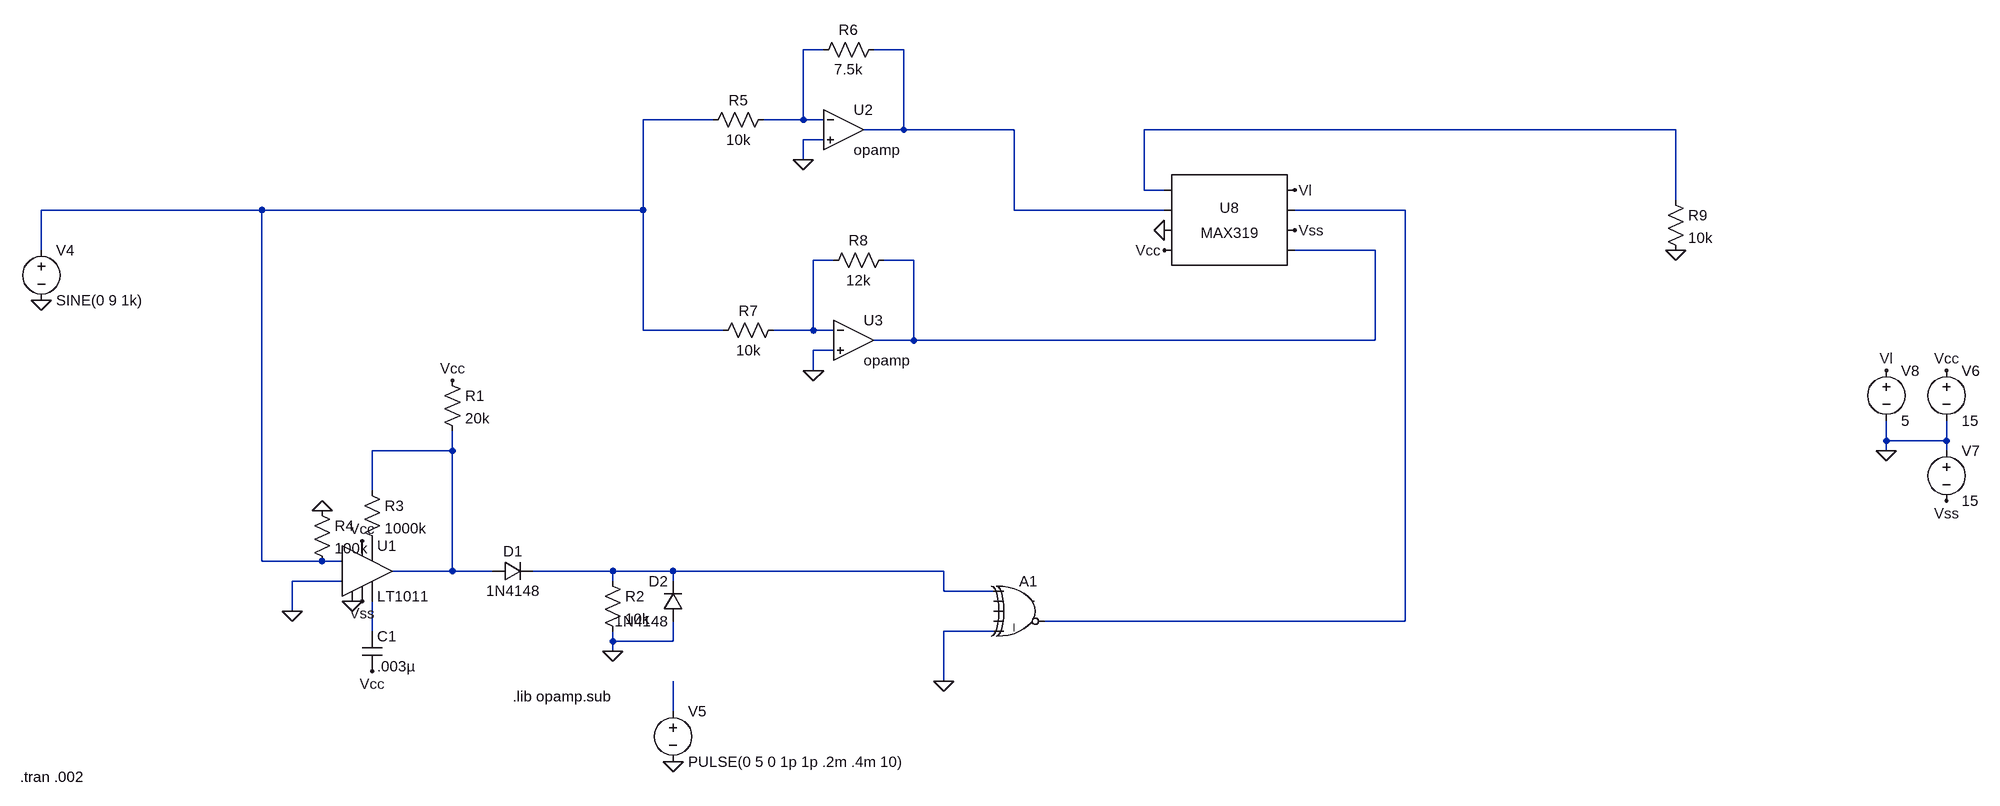
[diagram p0: schematic MAX319test.asc]
MAX319test.asc, the LTspice schematic file:
Version 4
SHEET 1 1932 680
WIRE 80 -864 48 -864
WIRE 208 -864 160 -864
WIRE -96 -752 -208 -752
WIRE 48 -752 48 -864
WIRE 48 -752 -16 -752
WIRE 80 -752 48 -752
WIRE 208 -736 208 -864
WIRE 208 -736 144 -736
WIRE 384 -736 208 -736
WIRE 1440 -736 592 -736
WIRE 80 -720 48 -720
WIRE 48 -688 48 -720
WIRE 592 -640 592 -736
WIRE 624 -640 592 -640
WIRE 1440 -624 1440 -736
WIRE -816 -608 -1168 -608
WIRE -208 -608 -208 -752
WIRE -208 -608 -816 -608
WIRE 384 -608 384 -736
WIRE 624 -608 384 -608
WIRE 1008 -608 832 -608
WIRE -1168 -544 -1168 -608
WIRE 960 -544 832 -544
WIRE 96 -528 64 -528
WIRE 224 -528 176 -528
WIRE -208 -416 -208 -608
WIRE -80 -416 -208 -416
WIRE 64 -416 64 -528
WIRE 64 -416 0 -416
WIRE 96 -416 64 -416
WIRE 224 -400 224 -528
WIRE 224 -400 160 -400
WIRE 960 -400 960 -544
WIRE 960 -400 224 -400
WIRE 96 -384 64 -384
WIRE 64 -352 64 -384
WIRE 1776 -240 1776 -272
WIRE 1872 -240 1872 -272
WIRE 1872 -240 1776 -240
WIRE -512 -224 -512 -256
WIRE -512 -224 -640 -224
WIRE 1776 -224 1776 -240
WIRE 1872 -224 1872 -240
WIRE -640 -160 -640 -224
WIRE -816 -48 -816 -608
WIRE -720 -48 -816 -48
WIRE -688 -48 -720 -48
WIRE -512 -32 -512 -224
WIRE -512 -32 -608 -32
WIRE -448 -32 -512 -32
WIRE -256 -32 -384 -32
WIRE -160 -32 -256 -32
WIRE 272 -32 -160 -32
WIRE -688 -16 -768 -16
WIRE -256 -16 -256 -32
WIRE -160 -16 -160 -32
WIRE 272 0 272 -32
WIRE 352 0 272 0
WIRE -768 32 -768 -16
WIRE 1008 48 1008 -608
WIRE 1008 48 432 48
WIRE -640 64 -640 16
WIRE 352 64 272 64
WIRE -256 80 -256 64
WIRE -160 80 -160 48
WIRE -160 80 -256 80
WIRE -256 96 -256 80
WIRE 272 144 272 64
WIRE -160 192 -160 144
FLAG -512 -336 Vcc
FLAG -656 -80 Vcc
FLAG -640 128 Vcc
FLAG -656 16 Vss
FLAG -256 96 0
FLAG -672 16 0
FLAG -768 32 0
FLAG -720 -128 0
FLAG 48 -688 0
FLAG 64 -352 0
FLAG 1440 -544 0
FLAG -1168 -464 0
FLAG -160 272 0
FLAG 1872 -144 Vss
FLAG 1872 -352 Vcc
FLAG 1776 -224 0
FLAG 1776 -352 Vl
FLAG 832 -640 Vl
FLAG 624 -544 Vcc
FLAG 832 -576 Vss
FLAG 624 -576 0
FLAG 272 144 0
SYMBOL LT1011 -656 -32 R0
SYMATTR InstName U1
SYMBOL res -528 -352 R0
SYMATTR InstName R1
SYMATTR Value 20k
SYMBOL res -272 -32 R0
SYMATTR InstName R2
SYMATTR Value 10k
SYMBOL cap -656 64 R0
SYMATTR InstName C1
SYMATTR Value .003µ
SYMBOL res -656 -176 R0
SYMATTR InstName R3
SYMATTR Value 1000k
SYMBOL diode -448 -16 R270
WINDOW 0 32 32 VTop 2
WINDOW 3 0 32 VBottom 2
SYMATTR InstName D1
SYMATTR Value 1N4148
SYMBOL diode -144 48 R180
WINDOW 0 24 64 Left 2
WINDOW 3 24 0 Left 2
SYMATTR InstName D2
SYMATTR Value 1N4148
SYMBOL res -736 -144 R0
SYMATTR InstName R4
SYMATTR Value 100k
SYMBOL opamp 112 -800 R0
SYMATTR InstName U2
SYMBOL res 0 -768 R90
WINDOW 0 0 56 VBottom 2
WINDOW 3 32 56 VTop 2
SYMATTR InstName R5
SYMATTR Value 10k
SYMBOL res 176 -880 R90
WINDOW 0 0 56 VBottom 2
WINDOW 3 32 56 VTop 2
SYMATTR InstName R6
SYMATTR Value 7.5k
SYMBOL opamp 128 -464 R0
SYMATTR InstName U3
SYMBOL res 16 -432 R90
WINDOW 0 0 56 VBottom 2
WINDOW 3 32 56 VTop 2
SYMATTR InstName R7
SYMATTR Value 10k
SYMBOL res 192 -544 R90
WINDOW 0 0 56 VBottom 2
WINDOW 3 32 56 VTop 2
SYMATTR InstName R8
SYMATTR Value 12k
SYMBOL AutoGenerated\\MAX319 720 -592 R0
SYMATTR InstName U8
SYMBOL res 1424 -640 R0
SYMATTR InstName R9
SYMATTR Value 10k
SYMBOL voltage -1168 -560 R0
WINDOW 123 0 0 Left 2
WINDOW 39 0 0 Left 2
SYMATTR InstName V4
SYMATTR Value SINE(0 9 1k)
SYMBOL voltage -160 176 R0
WINDOW 123 0 0 Left 2
WINDOW 39 0 0 Left 2
SYMATTR InstName V5
SYMATTR Value PULSE(0 5 0 1p 1p .2m .4m 10)
SYMBOL voltage 1872 -368 R0
WINDOW 123 0 0 Left 2
WINDOW 39 0 0 Left 2
SYMATTR InstName V6
SYMATTR Value 15
SYMBOL voltage 1872 -240 R0
WINDOW 123 0 0 Left 2
WINDOW 39 0 0 Left 2
SYMATTR InstName V7
SYMATTR Value 15
SYMBOL voltage 1776 -368 R0
WINDOW 123 0 0 Left 2
WINDOW 39 0 0 Left 2
SYMATTR InstName V8
SYMATTR Value 5
SYMBOL Digital\\xor 400 -32 R0
WINDOW 3 0 0 Invisible 2
SYMATTR InstName A1
SYMATTR Value Vhigh=5 Vlow=0
SYMATTR Value2 Td=2n Trise=10n Tfall=10n
TEXT -416 168 Left 2 !.lib opamp.sub
TEXT -1202 296 Left 2 !.tran .002

The netlist it stands for:
* MAX319test.asc
XU1 0 0 N003 Vss P001 N010 N008 Vcc LT1011
R1 Vcc N008 20k
R2 N009 0 10k
C1 N010 Vcc .003µ
R3 N008 P001 1000k
D1 N008 N009 1N4148
D2 0 N009 1N4148
R4 0 N003 100k
XU2 N001 0 N002 opamp Aol=100K GBW=10Meg  ; pins invin noninvin out
R5 N001 N003 10k
R6 N002 N001 7.5k
XU3 N007 0 N006 opamp Aol=100K GBW=10Meg  ; pins invin noninvin out
R7 N007 N003 10k
R8 N006 N007 12k
* U8: MAX319 (symbol AutoGenerated\MAX319 not available, pins judged from their places): pin1=N004 pin2=N002 pin3=0 pin4=Vcc pin5=Vl pin6=N005 pin7=Vss pin8=N006
R9 N004 0 10k
V4 N003 0 SINE(0 9 1k)
V5 N011 0 PULSE(0 5 0 1p 1p .2m .4m 10)
V6 Vcc 0 15
V7 0 Vss 15
V8 Vl 0 5
A1 N009 0 0 0 0 N005 0 0 XOR Vhigh=5 Vlow=0 Td=2n Trise=10n Tfall=10n
.model D D
.lib standard.dio
.lib opamp.sub
.tran .002
.lib LTC1.lib
.backanno
.end